# Altium schematic sheet SCH.SchDoc
size A4; PageSetup: Record=PageOptions|CenterHorizontal=True|CenterVertical=True|PrintScale=1.00|XCorrection=1.00|YCorrection=1.00|PrintKind=1|BorderSize=5000000|LeftOffset=0|BottomOffset=0|Orientation=2|PaperLength=1000|PaperWidth=1000|Scale=100|PaperSource=7|PrintQuality=-4|MediaType=1|DitherType=10|PrintScaleMode=1|PaperKind=16K 197x273 mm|PaperIndex=121
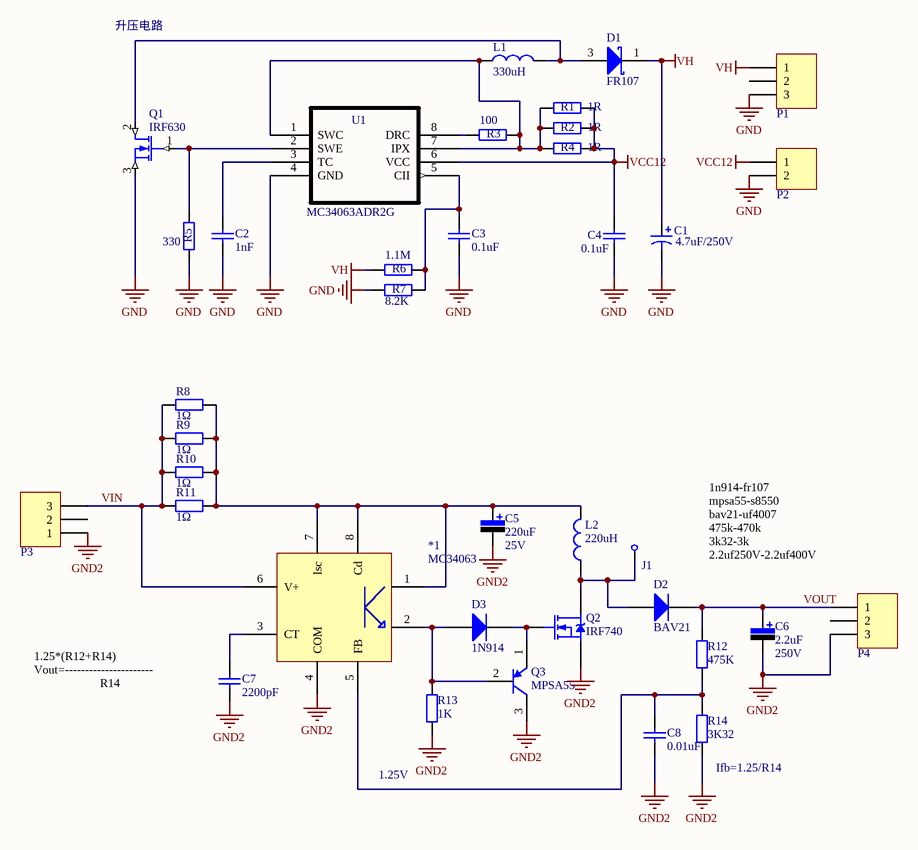
[diagram p0: SCH.SchDoc]

## Parts
*1  MC34063  [SOP-8]
C1  value 4.7uF/250V  [1812]  (hidden comment: Cap Pol3)
C2  value 1nF  [0805]  (hidden comment: Cap)
C3  value 0.1uF  [0805]  (hidden comment: Cap)
C4  value 0.1uF  [0805]  (hidden comment: Cap)
C5  value 220uF  Vol: 25V  [C-RB-6]  (hidden comment: Cap Pol)
C6  value 2.2uF  Vol: 250V  [C-RB-8]  (hidden comment: Cap Pol)
C7  value 2200pF  [C-RAD-0805]  (hidden comment: Cap)
C8  value 0.01uF  [C-RAD-0805]  (hidden comment: Cap)
D1  FR107  [DO-214AC]
D2  Type: BAV21  [DO-35]  (hidden comment: Diode)
D3  Type: 1N914  [DIODE-SMA]  (hidden comment: Diode)
J1  CHECK  [CHECK-A]  (value not drawn)
L1  330uH  [330uH]
L2  value 220uH  [L-SMD-7]  (hidden comment: Inductor)
P1  Header 3  [HDR3X1_A]  (value not drawn)
P2  Header 2  [HDR2X1_A]  (value not drawn)
P3  Header 3  [HDR3X1_A]  (value not drawn)
P4  Header 3  [HDR3X1_A]  (value not drawn)
Q1  IRF630  [TO-263]
Q2  IRF740  [TO-220AB]
Q3  MPSA55  [TO-92A]
R1  value 1R  [0805]  (hidden comment: Res2)
R2  value 1R  [0805]  (hidden comment: Res2)
R3  value 100  [0805]  (hidden comment: Res2)
R4  value 1R  [0805]  (hidden comment: Res2)
R5  value 330  [0805]  (hidden comment: Res2)
R6  value 1.1M  [0805]  (hidden comment: Res2)
R7  value 8.2K  [0805]  (hidden comment: Res2)
R8  value 1Ω  [0805-1]  (hidden comment: Res1)
R9  value 1Ω  [0805-1]  (hidden comment: Res1)
R10  value 1Ω  [0805-1]  (hidden comment: Res1)
R11  value 1Ω  [0805-1]  (hidden comment: Res1)
R12  value 475K  [0805-1]  (hidden comment: Res1)
R13  value 1K  [0805-1]  (hidden comment: Res1)
R14  value 3K32  [0805-1]  (hidden comment: Res1)
U1  MC34063ADR2G  [SO-8-M]

## Nets
GND: C1.2 C2.1 C3.1 C4.1 P1.3 P2.2 Q1.3(S) R5.1 R7.1 U1.4(GND)
GND2: *1.4(COM) C5.2 C6.2 C7.1 C8.1 P3.1 P4.3 Q2.S Q3.3(C) R13.1 R14.1
VCC12: C4.2 P2.1 R1.2 R2.2 R4.2 U1.6(VCC)
VH: C1.1 D1.1(K) P1.1 R6.1
VIN: *1.6(V+) P3.3 R8.1 R9.1 R10.1 R11.1
VOUT: C6.1 D2.2(K) P4.1 R12.2
Net*1_1: *1.1 *1.7(Isc) *1.8(Cd) C5.1 L2.2 R8.2 R9.2 R10.2 R11.2
Net*1_2: *1.2 D3.1(A) Q3.2(B) R13.2
Net*1_3: *1.3(CT) C7.2
Net*1_5: *1.5(FB) C8.2 R12.1 R14.2
NetC2_2: C2.2 U1.3(TC)
NetC3_2: C3.2 R6.2 R7.2 U1.5(CII)
NetD1_3: D1.3(A) L1.1 Q1.2(D)
NetD2_1: D2.1(A) J1.1 L2.1 Q2.D
NetD3_2: D3.2(K) Q2.G Q3.1(E)
NetL1_2: L1.2 R1.1 R2.1 R3.1 R4.1 U1.1(SWC) U1.7(IPX)
NetQ1_1: Q1.1(G) R5.2 U1.2(SWE)
NetR3_2: R3.2 U1.8(DRC)

Not connected (* = marked no-connect by the designer): P1 2; P3 2; P4 2

## Notes on the sheet
- 升压电路
- 1n914-fr107
  mpsa55-s8550
  bav21-uf4007
  475k-470k
  3k32-3k
  2.2uf250V-2.2uf400V
- 1.25*(R12+R14)
  Vout=----------------------
  R14
- (near R13) 1.25V
- (near R14) Ifb=1.25/R14

## Library data of the parts
C1 = Cap Pol3: Polarized Capacitor (Surface Mount); Published: 8-Jun-2000; LatestRevisionDate: 29-May-2009; LatestRevisionNote: IPC-7351 Footprint Added.; PackageReference: C0805; Publisher: Altium Limited; PackageDescription: Chip Capacitor
C2-C4 = Cap: Capacitor; Published: 8-Jun-2000; LatestRevisionDate: 17-Jul-2002; LatestRevisionNote: Re-released for DXP Platform.; PackageReference: RAD-0.3; Publisher: Altium Limited; PackageDescription: Radial Cap, Thru-Hole; 2 Leads; 0.3 in Pin Spacing
C5 C6 = Cap Pol: 极性电解电容; Published: 8-Jun-2000; LatestRevisionDate: 17-Jul-2002; LatestRevisionNote: Re-released for DXP Platform.; PackageReference: RB7.6-15; Publisher: Altium Limited
C7 C8 = Cap: 无极性电容; Published: 8-Jun-2000; LatestRevisionDate: 17-Jul-2002; LatestRevisionNote: Re-released for DXP Platform.; PackageReference: RAD-0.3; Publisher: Altium Limited
D1 = Diode 18TQ045: Schottky Rectifier; Note: Terminal 2 is the TAB and is electrically connected to the cathode; Published: 8-Jun-2000; LatestRevisionDate: 17-Jul-2002; LatestRevisionNote: Re-released for DXP Platform.; DatasheetVersion: Dec-1997; PackageVersion: Feb-1998; PackageReference: TO-220AC; Publisher: Altium Limited; PackageDescription: TO, Thru-Hole, Vertical, Heatsink Mounted; 3 In-Line Leads (1 Absent); Pitch 2.54 mm; ComponentLink1Description: Manufacturer Link; ComponentLink1URL: http://www.irf.com/; ComponentLink2Description: Datasheet; ComponentLink2URL: http://www.irf.com/product-info/datasheets/data/18tq.pdf
D2 D3 = Diode: 二极管; Published: 8-Jun-2000; LatestRevisionDate: 17-Jul-2002; LatestRevisionNote: Re-released for DXP Platform.; PackageDocument: Sep-1996; PackageReference: SMC; Publisher: Altium Limited; Code_JEDEC: DO-214-AB
J1 = CHECK: 测试点
L1 = L
L2 = Inductor: 电感; Code_IEC: 1005; Published: 8-Jun-2000; LatestRevisionDate: 17-Jul-2002; LatestRevisionNote: Re-released for DXP Platform.; PackageReference: 0402-A; Publisher: Altium Limited; Code_JEITA: 0402
P1 P3 P4 = Header 3: 接插件; LatestRevisionDate: 17-Jul-2002; LatestRevisionNote: Re-released for DXP Platform.; Publisher: Altium Limited
P2 = Header 2: 接插件; LatestRevisionDate: 17-Jul-2002; LatestRevisionNote: Re-released for DXP Platform.; Publisher: Altium Limited
Q1 = IRF630: N-Channel MOSFET
Q2 = MOSFET-N: N-Channel MOSFET; PackageDocument: 1995/1996; Published: 8-Jun-2000; LatestRevisionDate: 17-Jul-2002; LatestRevisionNote: Re-released for DXP Platform.; PackageReference: E3; Publisher: Altium Limited
Q3 = S8550: PNP三极管; Published: 8-Jun-2000; LatestRevisionDate: 15-Jan-2003; LatestRevisionNote: PCB Footprint 'BCY-W3/D4.7' replaced; DatasheetDocument: 1997; PackageDocument: Sep-1998; PackageReference: TO-92A; Publisher: Altium Limited; Code_JEDEC: TO-92A; ComponentLink1Description: Manufacturer Link; ComponentLink1URL: http://www.fairchildsemi.com/; ComponentLink2Description: Datasheet; ComponentLink2URL: http://www.fairchildsemi.com/ds/2N%2F2N3906.pdf
R1-R7 = Res2: Resistor; Published: 8-Jun-2000; LatestRevisionDate: 17-Jul-2002; LatestRevisionNote: Re-released for DXP Platform.; PackageReference: AXIAL-0.4; Publisher: Altium Limited; PackageDescription: Axial Device, Thru-Hole; 2 Leads; 0.4 in Pin Spacing
R8-R14 = Res1: 贴片电阻; Published: 8-Jun-2000; LatestRevisionDate: 17-Jul-2002; LatestRevisionNote: Re-released for DXP Platform.; PackageReference: AXIAL-0.4; Publisher: Altium Limited
U1 = MC34063ACD-TR: Imported; Manufacturer_Part_Number: MC34063ADR2G